# EAGLE design PID_interface_01 (EAGLE 9.6.0)
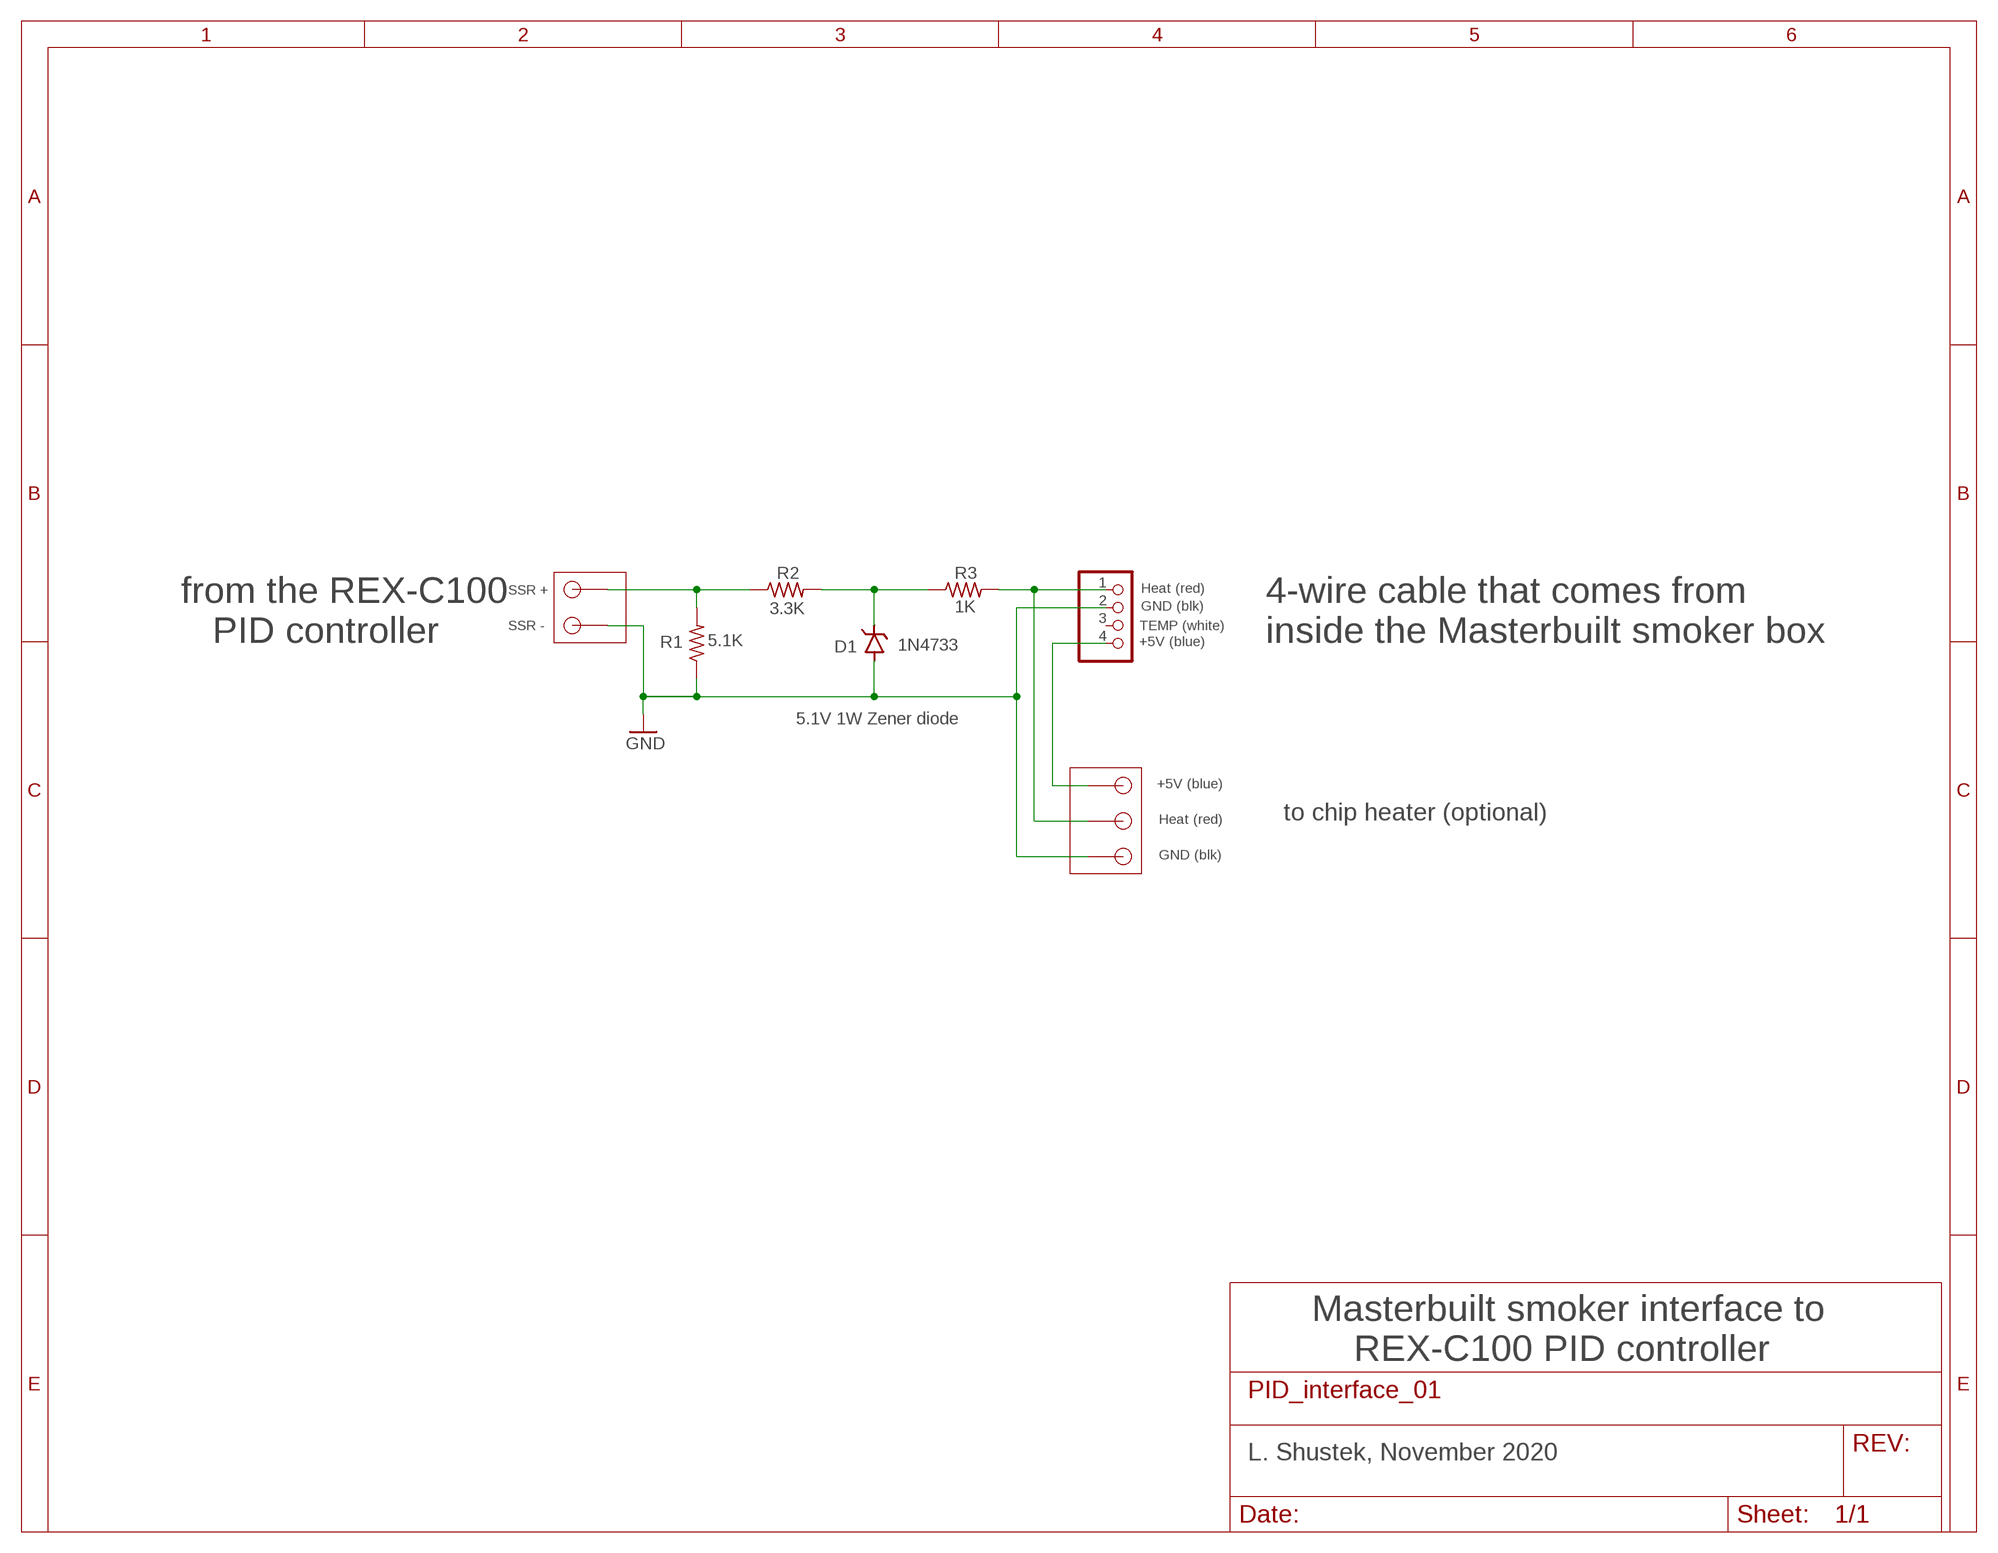
[diagram p0: schematic, sheet 1]

## Parts
D1  1N4733  DIODE,ZENER1  [DO35-10]
JP1  PINHD-1X4  [1X04]
R1  5.1K  R-US_0207/10  [0207/10]
R2  3.3K  R-US_0207/10  [0207/10]
R3  1K  R-US_0207/10  [0207/10]
U$1  CONNECTOR-2PINTHIN  [CONNECTOR-2PIN-5MM_THIN]
U$2  CONNECTOR-3PIN  [CONNECTOR-3PIN-5MM_THIN]

## Nets
+5V: JP1.4 U$2.P$1
GND: D1.A JP1.2 R1.1 U$1.P$1 U$2.P$3
HEAT: JP1.1 R3.2 U$2.P$2
N$1: R1.2 R2.1 U$1.P$2
N$2: D1.C R2.2 R3.1
Unconnected: JP1.3

## Notes on the sheet
- SSR + | Heat (red)
- GND (blk)
- SSR - | TEMP (white)
- from the REX-C100 
     PID controller
- 4-wire cable that comes from 
  inside the Masterbuilt smoker box
- +5V (blue)
- 5.1V 1W Zener diode
- +5V (blue)
- Heat (red) | to chip heater (optional)
- GND (blk)
- Masterbuilt smoker interface to
      REX-C100 PID controller
- L. Shustek, November 2020

## Library data of the parts
D1 = Len:DIODE,ZENER: Zener diode
JP1 = pinhead:PINHD-1X4: PIN HEADER
R1-R3 = resistor:R-US_: RESISTOR, American symbol
U$1 = Len:CONNECTOR-2PIN
U$2 = Len:CONNECTOR-3PIN: 3-pin wire-to-board connector

## Net classes
0 default: width 1.27 mm, clearance 0.635 mm

## Board
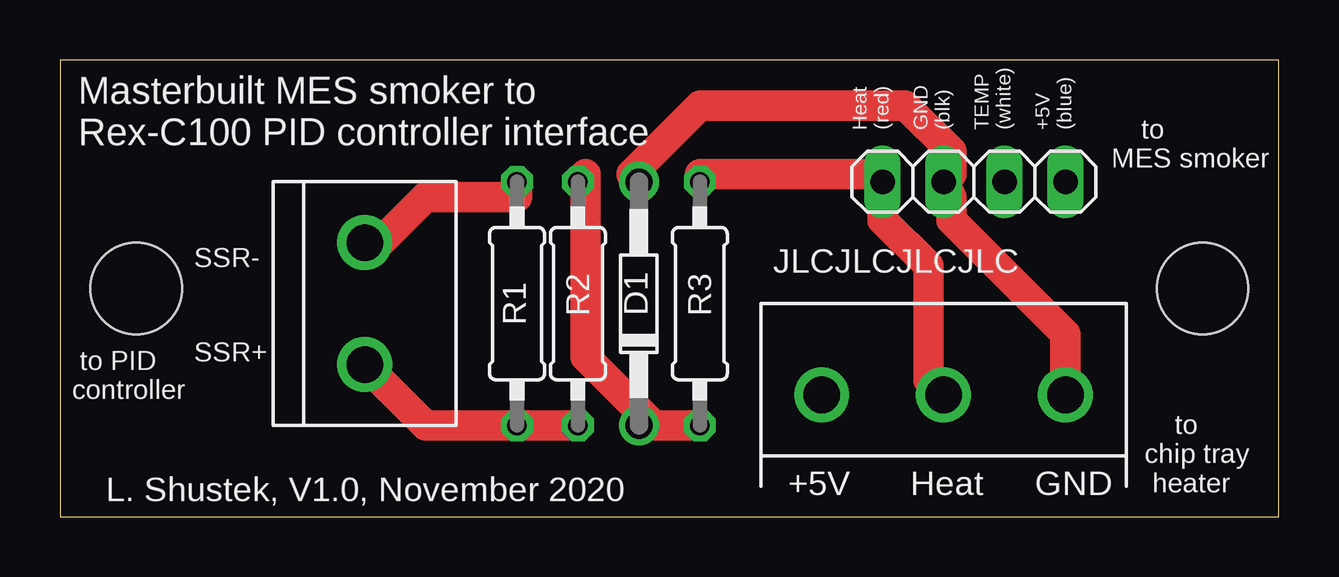
[diagram p1: board, top side]
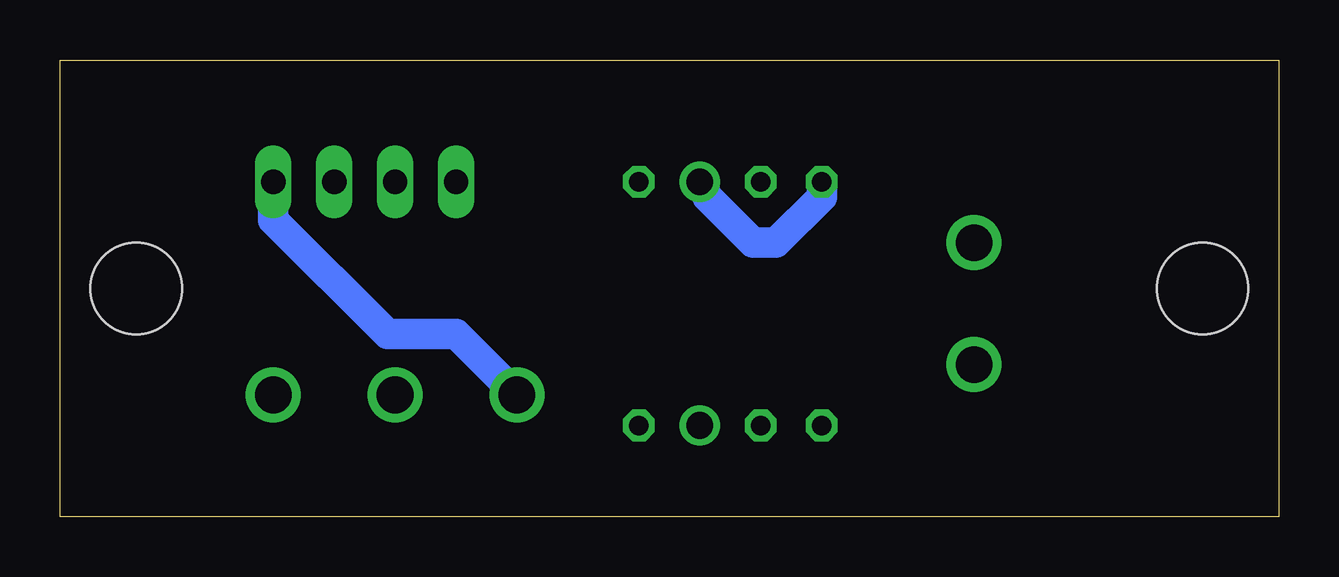
[diagram p2: board, bottom side, seen from below]

Size 50.8 x 19.05 mm. Coordinates in mm from the lower left corner, seen from the top.
Outline: 0,0 50.8,0 50.8,19.05 0,19.05 0,0
Copper layers (1*16): Top 0.035mm / dielectric 1.5mm / Bottom 0.035mm
Design rules "default": minimum track width 6mil, minimum drill 0.35mm, track to track 6mil, track to pad 6mil, pad to pad 6mil, via to via 6mil, smd to smd 6mil, copper to edge 40mil, drill to drill 6mil, minimum pad ring 10mil, minimum via ring 8mil, stop-mask expansion 4mil, vias tented up to drill 0mil, thermal gap 10mil
Holes 3.81 mm at 3.17,9.53 47.62,9.53

### Footprints (pad centres in the part's own frame; a part is rotated, then mirrored left to right if it is on the bottom)
DO35-10 = drill 1.118: A 5.08,0; C -5.08,0
1X04 = drill 1.016 long: 1 -3.81,0; 2 -1.27,0; 3 1.27,0; 4 3.81,0
0207/10 = drill 0.813 octagon: 1 -5.08,0; 2 5.08,0
CONNECTOR-2PIN-5MM_THIN = drill 1.524: P$1 0,2.54; P$2 0,-2.54
CONNECTOR-3PIN-5MM_THIN = drill 1.524: P$1 0,5.08; P$2 0,0; P$3 0,-5.08

### Placement (x,y rotation side)
D1  24.13,8.89 90 top
JP1  38.1,13.97 0 top
R1  19.05,8.89 270 top
R2  21.59,8.89 90 top
R3  26.67,8.89 90 top
U$1  12.7,8.89 0 top
U$2  36.83,5.08 90 top

### Tracks (layer width: path | path; a pad name or v marks a point on that pad's centre or on a via)
+5V
  Bottom 1.27: JP1.4 41.91,12.38 37.15,7.62 34.29,7.62 U$2.P$1
GND
  Top 1.27: U$2.P$3 41.91,7.62 37.15,12.38 37.15,13.34 JP1.2 37.15,14.29 37.15,15.24 35.24,17.14 26.67,17.14 23.81,14.29 D1.A | R1.1 19.05,13.34 15.24,13.34 13.34,11.43 U$1.P$1
  Bottom 1.27: D1.A 23.81,13.34 21.91,11.43 20.95,11.43 19.05,13.34 R1.1
HEAT
  Top 1.27: R3.2 26.67,14.29 34.29,14.29 JP1.1 34.29,12.38 36.2,10.48 36.2,5.71 U$2.P$2
N$1
  Top 1.27: R2.1 R1.2 15.24,3.81 U$1.P$2
N$2
  Top 1.27: 24.77,3.81 R3.1 | 24.77,3.81 21.91,6.67 21.91,14.29 R2.2 | 24.77,3.81 D1.C

### Text on the board
tPlace: Heat / (red) | GND / (blk) | TEMP / (white) | +5V / (blue) | Masterbuilt MES smoker to / Rex-C100 PID controller interface | to / MES smoker | SSR- | JLCJLCJLCJLC | SSR+ | to PID / controller | L. Shustek, V1.0, November 2020 | +5V | Heat | GND | to / chip tray / heater